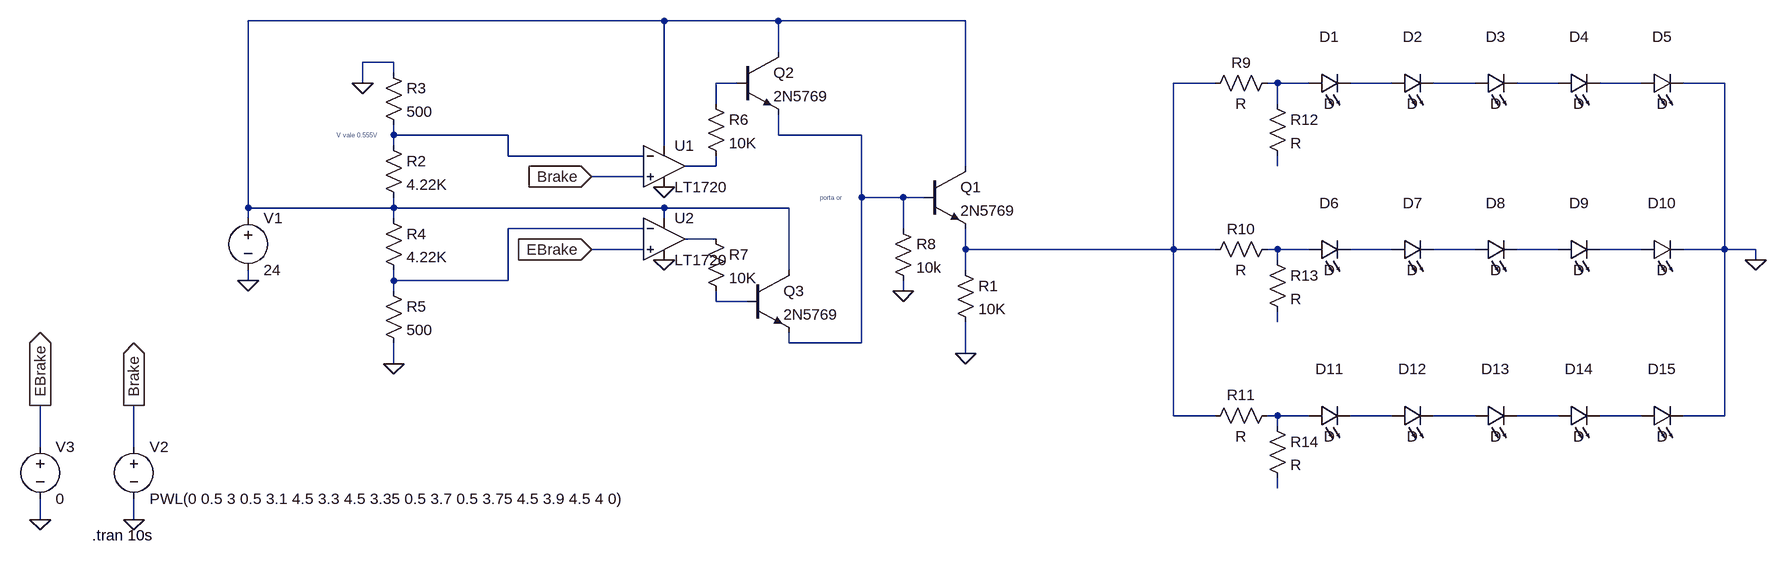
[diagram p0: schematic Schematic.asc]
Schematic.asc, the LTspice schematic file:
Version 4.1
SHEET 1 2752 728
WIRE 112 -80 -528 -80
WIRE 288 -80 112 -80
WIRE 576 -80 288 -80
WIRE 288 -32 288 -80
WIRE -304 -16 -352 -16
WIRE -304 0 -304 -16
WIRE -352 16 -352 -16
WIRE 224 16 192 16
WIRE 960 16 896 16
WIRE 1056 16 1040 16
WIRE 1104 16 1056 16
WIRE 1232 16 1168 16
WIRE 1360 16 1296 16
WIRE 1488 16 1424 16
WIRE 1616 16 1552 16
WIRE 1744 16 1680 16
WIRE 192 48 192 16
WIRE 1056 48 1056 16
WIRE -304 96 -304 80
WIRE -128 96 -304 96
WIRE 288 96 288 64
WIRE 416 96 288 96
WIRE -304 112 -304 96
WIRE 112 112 112 -80
WIRE -128 128 -128 96
WIRE 80 128 -128 128
WIRE 192 144 192 128
WIRE 192 144 144 144
WIRE 576 144 576 -80
WIRE 1056 144 1056 128
WIRE 80 160 0 160
WIRE 416 192 416 96
WIRE 480 192 416 192
WIRE 512 192 480 192
WIRE -528 208 -528 -80
WIRE -304 208 -304 192
WIRE -304 208 -528 208
WIRE 112 208 -304 208
WIRE 304 208 112 208
WIRE -528 224 -528 208
WIRE -304 224 -304 208
WIRE 112 224 112 208
WIRE 80 240 -128 240
WIRE 480 240 480 192
WIRE 192 256 144 256
WIRE 80 272 0 272
WIRE 576 272 576 240
WIRE 896 272 896 16
WIRE 896 272 576 272
WIRE 960 272 896 272
WIRE 1056 272 1040 272
WIRE 1104 272 1056 272
WIRE 1232 272 1168 272
WIRE 1360 272 1296 272
WIRE 1488 272 1424 272
WIRE 1616 272 1552 272
WIRE 1744 272 1744 16
WIRE 1744 272 1680 272
WIRE 1792 272 1744 272
WIRE 1056 288 1056 272
WIRE 1792 288 1792 272
WIRE 304 304 304 208
WIRE 576 304 576 272
WIRE -528 320 -528 304
WIRE -304 320 -304 304
WIRE -128 320 -128 240
WIRE -128 320 -304 320
WIRE -304 336 -304 320
WIRE 480 336 480 320
WIRE 192 352 192 336
WIRE 240 352 192 352
WIRE 1056 384 1056 368
WIRE 304 416 304 400
WIRE 416 416 416 192
WIRE 416 416 304 416
WIRE 576 432 576 384
WIRE -304 448 -304 416
WIRE 896 528 896 272
WIRE 960 528 896 528
WIRE 1056 528 1040 528
WIRE 1104 528 1056 528
WIRE 1232 528 1168 528
WIRE 1360 528 1296 528
WIRE 1488 528 1424 528
WIRE 1616 528 1552 528
WIRE 1744 528 1744 272
WIRE 1744 528 1680 528
WIRE 1056 544 1056 528
WIRE -848 576 -848 512
WIRE -704 576 -704 512
WIRE 1056 640 1056 624
WIRE -848 688 -848 656
WIRE -704 688 -704 656
FLAG -528 320 0
FLAG 576 432 0
FLAG 0 160 Brake
IOPIN 0 160 In
FLAG 0 272 EBrake
IOPIN 0 272 In
FLAG 112 176 0
FLAG 112 288 0
FLAG -352 16 0
FLAG -304 448 0
FLAG -704 512 Brake
IOPIN -704 512 Out
FLAG -704 688 0
FLAG 480 336 0
FLAG -848 512 EBrake
IOPIN -848 512 Out
FLAG -848 688 0
FLAG 1792 288 0
SYMBOL npn 512 144 R0
SYMATTR InstName Q1
SYMATTR Value 2N5769
SYMBOL voltage -528 208 R0
WINDOW 123 0 0 Left 0
WINDOW 39 0 0 Left 0
SYMATTR InstName V1
SYMATTR Value 24
SYMBOL res 560 288 R0
SYMATTR InstName R1
SYMATTR Value 10K
SYMATTR SpiceLine tol=1 pwr=0.1
SYMBOL res -320 96 R0
SYMATTR InstName R2
SYMATTR Value 4.22K
SYMATTR SpiceLine tol=1 pwr=0.1
SYMBOL res -320 -16 R0
SYMATTR InstName R3
SYMATTR Value 500
SYMATTR SpiceLine tol=1 pwr=0.1
SYMBOL res -320 208 R0
SYMATTR InstName R4
SYMATTR Value 4.22K
SYMATTR SpiceLine tol=1 pwr=0.1
SYMBOL res -320 320 R0
SYMATTR InstName R5
SYMATTR Value 500
SYMATTR SpiceLine tol=1 pwr=0.1
SYMBOL voltage -704 560 R0
WINDOW 123 0 0 Left 0
WINDOW 39 0 0 Left 0
SYMATTR InstName V2
SYMATTR Value PWL(0 0.5 3 0.5 3.1 4.5 3.3 4.5 3.35 0.5 3.7 0.5 3.75 4.5 3.9 4.5 4 0)
SYMBOL Comparators\\LT1720 112 80 R0
SYMATTR InstName U1
SYMBOL Comparators\\LT1720 112 192 R0
SYMATTR InstName U2
SYMBOL npn 224 -32 R0
SYMATTR InstName Q2
SYMATTR Value 2N5769
SYMBOL res 176 32 R0
SYMATTR InstName R6
SYMATTR Value 10K
SYMATTR SpiceLine tol=1 pwr=0.1
SYMBOL res 176 240 R0
SYMATTR InstName R7
SYMATTR Value 10K
SYMATTR SpiceLine tol=1 pwr=0.1
SYMBOL res 464 224 R0
SYMATTR InstName R8
SYMATTR Value 10k
SYMATTR SpiceLine tol=1 pwr=0.1
SYMBOL voltage -848 560 R0
WINDOW 123 0 0 Left 0
WINDOW 39 0 0 Left 0
SYMATTR InstName V3
SYMATTR Value 0
SYMBOL npn 240 304 R0
SYMATTR InstName Q3
SYMATTR Value 2N5769
SYMBOL LED 1104 32 R270
WINDOW 0 72 32 VTop 2
WINDOW 3 0 32 VBottom 2
SYMATTR InstName D1
SYMBOL LED 1232 32 R270
WINDOW 0 72 32 VTop 2
WINDOW 3 0 32 VBottom 2
SYMATTR InstName D2
SYMBOL LED 1360 32 R270
WINDOW 0 72 32 VTop 2
WINDOW 3 0 32 VBottom 2
SYMATTR InstName D3
SYMBOL LED 1488 32 R270
WINDOW 0 72 32 VTop 2
WINDOW 3 0 32 VBottom 2
SYMATTR InstName D4
SYMBOL LED 1616 32 R270
WINDOW 0 72 32 VTop 2
WINDOW 3 0 32 VBottom 2
SYMATTR InstName D5
SYMBOL LED 1104 288 R270
WINDOW 0 72 32 VTop 2
WINDOW 3 0 32 VBottom 2
SYMATTR InstName D6
SYMBOL LED 1232 288 R270
WINDOW 0 72 32 VTop 2
WINDOW 3 0 32 VBottom 2
SYMATTR InstName D7
SYMBOL LED 1360 288 R270
WINDOW 0 72 32 VTop 2
WINDOW 3 0 32 VBottom 2
SYMATTR InstName D8
SYMBOL LED 1488 288 R270
WINDOW 0 72 32 VTop 2
WINDOW 3 0 32 VBottom 2
SYMATTR InstName D9
SYMBOL LED 1616 288 R270
WINDOW 0 72 32 VTop 2
WINDOW 3 0 32 VBottom 2
SYMATTR InstName D10
SYMBOL LED 1104 544 R270
WINDOW 0 72 32 VTop 2
WINDOW 3 0 32 VBottom 2
SYMATTR InstName D11
SYMBOL LED 1232 544 R270
WINDOW 0 72 32 VTop 2
WINDOW 3 0 32 VBottom 2
SYMATTR InstName D12
SYMBOL LED 1360 544 R270
WINDOW 0 72 32 VTop 2
WINDOW 3 0 32 VBottom 2
SYMATTR InstName D13
SYMBOL LED 1488 544 R270
WINDOW 0 72 32 VTop 2
WINDOW 3 0 32 VBottom 2
SYMATTR InstName D14
SYMBOL LED 1616 544 R270
WINDOW 0 72 32 VTop 2
WINDOW 3 0 32 VBottom 2
SYMATTR InstName D15
SYMBOL res 1056 0 R90
WINDOW 0 0 56 VBottom 2
WINDOW 3 32 56 VTop 2
SYMATTR InstName R9
SYMBOL res 1056 256 R90
WINDOW 0 0 56 VBottom 2
WINDOW 3 32 56 VTop 2
SYMATTR InstName R10
SYMBOL res 1056 512 R90
WINDOW 0 0 56 VBottom 2
WINDOW 3 32 56 VTop 2
SYMATTR InstName R11
SYMBOL res 1040 32 R0
SYMATTR InstName R12
SYMBOL res 1040 272 R0
SYMATTR InstName R13
SYMBOL res 1040 528 R0
SYMATTR InstName R14
TEXT -392 96 Left 0 ;V vale 0.555V
TEXT 352 192 Left 0 ;porta or
TEXT -768 712 Left 2 !.tran 10s

The netlist it stands for:
* Schematic.asc
Q1 N001 N010 N003 0 2N5769
V1 N001 0 24
R1 N003 0 10K tol=1 pwr=0.1
R2 N009 N001 4.22K tol=1 pwr=0.1
R3 0 N009 500 tol=1 pwr=0.1
R4 N001 N013 4.22K tol=1 pwr=0.1
R5 N013 0 500 tol=1 pwr=0.1
V2 Brake 0 PWL(0 0.5 3 0.5 3.1 4.5 3.3 4.5 3.35 0.5 3.7 0.5 3.75 4.5 3.9 4.5 4 0)
X§U1 Brake N009 N001 0 N011 LT1720  ; pins In+ In- V+ V- OUT
X§U2 EBrake N013 N001 0 N014 LT1720  ; pins In+ In- V+ V- OUT
Q2 N001 N002 N010 0 2N5769
R6 N002 N011 10K tol=1 pwr=0.1
R7 N014 N020 10K tol=1 pwr=0.1
R8 N010 0 10k tol=1 pwr=0.1
V3 EBrake 0 0
Q3 N001 N020 N010 0 2N5769
D1 N004 N005 D
D2 N005 N006 D
D3 N006 N007 D
D4 N007 N008 D
D5 N008 0 D
D6 N015 N016 D
D7 N016 N017 D
D8 N017 N018 D
D9 N018 N019 D
D10 N019 0 D
D11 N022 N023 D
D12 N023 N024 D
D13 N024 N025 D
D14 N025 N026 D
D15 N026 0 D
R9 N004 N003 R
R10 N015 N003 R
R11 N022 N003 R
R12 N004 N012 R
R13 N015 N021 R
R14 N022 N027 R
.model D D
.lib standard.dio
.model NPN NPN
.model PNP PNP
.lib standard.bjt
* V vale 0.555V
* porta or
.tran 10s
.lib LT1720.sub
.backanno
.end